# EAGLE design board_revA (EAGLE 7.1.0)
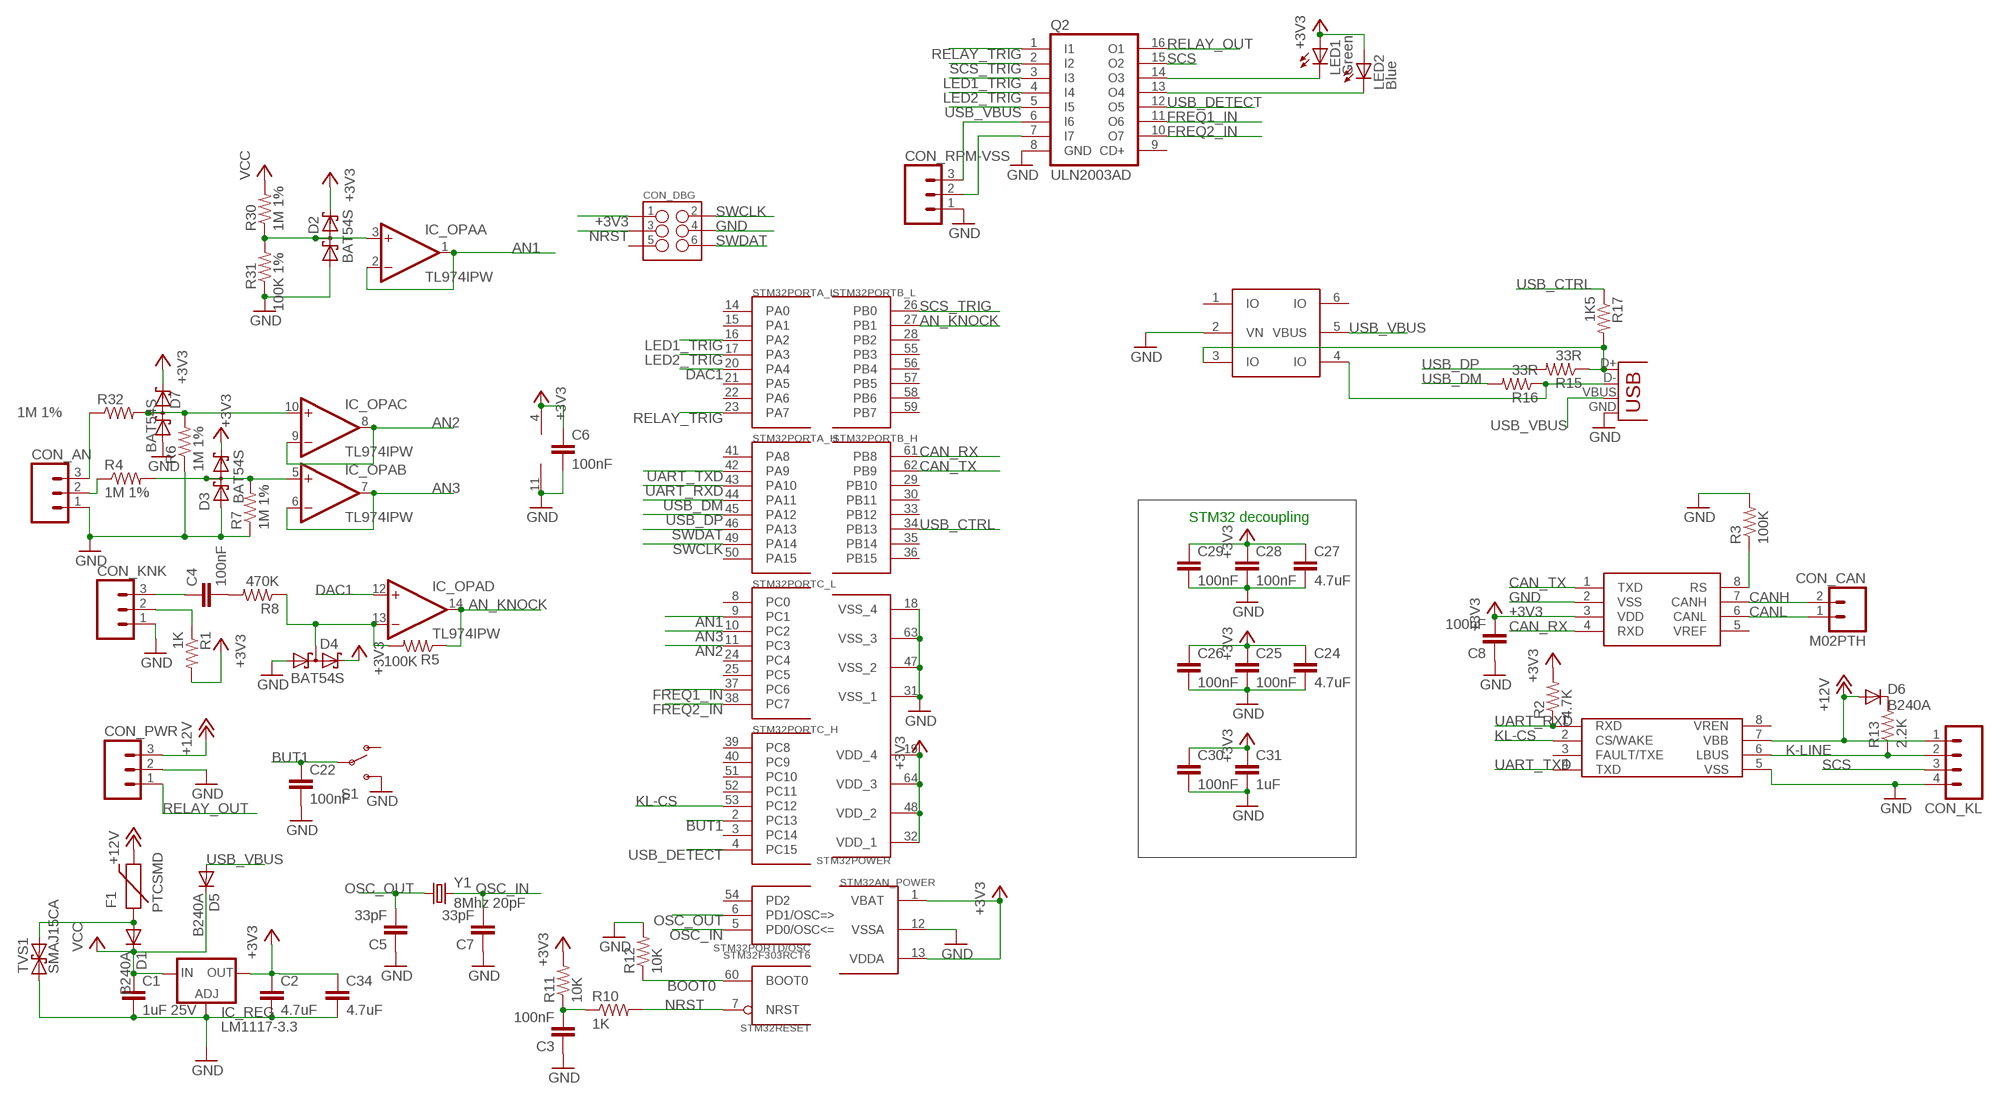
[diagram p0: schematic, sheet 1]

## Parts
C1  1uF 25V  CAP0603-CAP  [0603-CAP]
C2  4.7uF  CAP0603-CAP  [0603-CAP]
C3  100nF  CAP0603-CAP  [0603-CAP]
C4  100nF  CAP0603-CAP  [0603-CAP]
C5  33pF  CAP0603-CAP  [0603-CAP]
C6  100nF  CAP0603-CAP  [0603-CAP]
C7  33pF  CAP0603-CAP  [0603-CAP]
C8  100nF  CAP0603-CAP  [0603-CAP]
C22  100nF  CAP0603-CAP  [0603-CAP]
C24  4.7uF  CAP0603-CAP  [0603-CAP]
C25  100nF  CAP0603-CAP  [0603-CAP]
C26  100nF  CAP0603-CAP  [0603-CAP]
C27  4.7uF  CAP0603-CAP  [0603-CAP]
C28  100nF  CAP0603-CAP  [0603-CAP]
C29  100nF  CAP0603-CAP  [0603-CAP]
C30  100nF  CAP0603-CAP  [0603-CAP]
C31  1uF  CAP0603-CAP  [0603-CAP]
C34  4.7uF  CAP0603-CAP  [0603-CAP]
CON_AN  M03PTH  [1X03]
CON_CAN  M02PTH  [1X02]
CON_DBG  M03X22X3_SILK_SM  [2X3]
CON_KL  M04PTH  [1X04]
CON_KNK  M03PTH  [1X03]
CON_PWR  M03PTH  [1X03]
CON_RPM-VSS  M03PTH  [1X03]
CON_USB  USBSMD  [USB-MINIB]
D1  B240A  DIODESMA  [SMA-DIODE]
D2  BAT54S  [SOT23]
D3  BAT54S  [SOT23]
D4  BAT54S  [SOT23]
D5  B240A  DIODESMA  [SMA-DIODE]
D6  B240A  DIODESMA  [SMA-DIODE]
D7  BAT54S  [SOT23]
F1  PTCSMD  [PTC-1206]
IC_CAN  MAX3051  MCP2551  [SO08]
IC_KLINE  MCP2004  [SO08]
IC_OPA  TL974IPW  LMV324MZ  [TSSOP14]
IC_REG  LM1117-3.3  LD117ADT33TR  [DPACK]
LED1  Green  LED3MM  [LED3MM]
LED2  Blue  LED3MM  [LED3MM]
Q2  ULN2003AD  [SO16]
R1  1K  RESISTOR0603-RES  [0603-RES]
R2  4.7K  RESISTOR0603-RES  [0603-RES]
R3  100K  RESISTOR0603-RES  [0603-RES]
R4  1M 1%  RESISTOR0603-RES  [0603-RES]
R5  100K  RESISTOR0603-RES  [0603-RES]
R6  1M 1%  RESISTOR0603-RES  [0603-RES]
R7  1M 1%  RESISTOR0603-RES  [0603-RES]
R8  470K  RESISTOR0603-RES  [0603-RES]
R10  1K  RESISTOR0603-RES  [0603-RES]
R11  10K  RESISTOR0603-RES  [0603-RES]
R12  10K  RESISTOR0603-RES  [0603-RES]
R13  2.2K  RESISTOR0603-RES  [0603-RES]
R15  33R  RESISTOR0603-RES  [0603-RES]
R16  33R  RESISTOR0603-RES  [0603-RES]
R17  1K5  RESISTOR0603-RES  [0603-RES]
R30  1M 1%  RESISTOR0603-RES  [0603-RES]
R31  100K 1%  RESISTOR0603-RES  [0603-RES]
R32  1M 1%  RESISTOR0603-RES  [0603-RES]
S1  SWITCH-SPDTPTH  [SWITCH-SPDT]
STM32  STM32F303RCT6  STM32F10XRXT6  [TQFP64]
TVS1  SMAJ15CA  TVS  [SMA-DIODE]
TVS2  NUP4201MR6  [SOT23-6]
Y1  8Mhz 20pF  CRYSTALHC49US  [HC49US]

## Nets
+3V3: C2.1 C6.1 C8.2 C24.1 C25.1 C26.1 C27.1 C28.1 C29.1 C30.1 C31.1 C34.1 CON_DBG.1 D2.2(C2) D3.2(C2) D4.2(C2) D7.2(C2) IC_CAN.3(VDD) IC_OPA.4(P:V+) IC_REG.4(OUT) LED1.A LED2.A R1.2 R2.2 R11.2 STM32.1(AN_POWER:VBAT) STM32.13(AN_POWER:VDDA) STM32.19(POWER:VDD_4) STM32.32(POWER:VDD_1) STM32.48(POWER:VDD_2) STM32.64(POWER:VDD_3)
+12V: CON_KL.1 CON_PWR.3 D6.A F1.2 IC_KLINE.7(VBB)
AN1: IC_OPA.1(A:OUT) IC_OPA.2(A:-IN) STM32.9(PORTC_L:PC1)
AN2: IC_OPA.8(C:OUT) IC_OPA.9(C:-IN) STM32.11(PORTC_L:PC3)
AN3: IC_OPA.6(B:-IN) IC_OPA.7(B:OUT) STM32.10(PORTC_L:PC2)
AN_KNOCK: IC_OPA.14(D:OUT) R5.1 STM32.27(PORTB_L:PB1)
BOOT0: R12.1 STM32.60(RESET:BOOT0)
BUT1: C22.1 S1.2(P) STM32.2(PORTC_H:PC13)
CAN_RX: IC_CAN.4(RXD) STM32.61(PORTB_H:PB8)
CAN_TX: IC_CAN.1(TXD) STM32.62(PORTB_H:PB9)
CANH: CON_CAN.2 IC_CAN.7(CANH)
CANL: CON_CAN.1 IC_CAN.6(CANL)
DAC1: IC_OPA.12(D:+IN) STM32.20(PORTA_L:PA4)
FREQ1_IN: Q2.11(O6) STM32.37(PORTC_L:PC6)
FREQ2_IN: Q2.10(O7) STM32.38(PORTC_L:PC7)
GND: C1.2 C2.2 C3.1 C5.1 C6.2 C7.1 C8.1 C22.2 C24.2 C25.2 C26.2 C27.2 C28.2 C29.2 C30.2 C31.2 C34.2 CON_AN.1 CON_DBG.4 CON_KL.4 CON_KNK.1 CON_PWR.2 CON_RPM-VSS.1 CON_USB.GND D2.1(A1) D3.1(A1) D4.1(A1) D7.1(A1) IC_CAN.2(VSS) IC_KLINE.5(VSS) IC_OPA.11(P:V-) IC_REG.1(ADJ) Q2.8(GND) R3.2 R6.1 R7.1 R12.2 R31.1 S1.3(S) STM32.12(AN_POWER:VSSA) STM32.18(POWER:VSS_4) STM32.31(POWER:VSS_1) STM32.47(POWER:VSS_2) STM32.63(POWER:VSS_3) TVS1.A TVS2.2(VN)
K-LINE: CON_KL.2 IC_KLINE.6(LBUS) R13.1
KL-CS: IC_KLINE.2(CS/WAKE) STM32.53(PORTC_H:PC12)
LED1_TRIG: Q2.3(I3) STM32.16(PORTA_L:PA2)
LED2_TRIG: Q2.4(I4) STM32.17(PORTA_L:PA3)
N$1: CON_KNK.2 R1.1
N$2: CON_AN.3 R32.1
N$3: CON_AN.2 R4.1
N$4: C4.1 CON_KNK.3
N$5: D3.3(C1A2) IC_OPA.5(B:+IN) R4.2 R7.2
N$6: C4.2 R8.2
N$7: CON_USB.D+ R15.1 R17.2 TVS2.3(IO)
N$8: IC_CAN.8(RS) R3.1
N$9: D1.A F1.1 TVS1.C
N$10: LED1.K(C) Q2.14(O3)
N$11: LED2.K(C) Q2.13(O4)
N$12: D4.3(C1A2) IC_OPA.13(D:-IN) R5.2 R8.1
N$13: D6.C R13.2
N$16: CON_RPM-VSS.3 Q2.6(I6)
N$17: CON_USB.D- R16.1 TVS2.4(IO)
N$18: C3.2 R10.1 R11.1
N$21: CON_RPM-VSS.2 Q2.7(I7)
N$24: D2.3(C1A2) IC_OPA.3(A:+IN) R30.1 R31.2
N$25: D7.3(C1A2) IC_OPA.10(C:+IN) R6.2 R32.2
NRST: CON_DBG.3 R10.2 STM32.7(RESET:NRST)
OSC_IN: C7.2 STM32.5(PORTD/OSC:PD0/OSC<=) Y1.2
OSC_OUT: C5.2 STM32.6(PORTD/OSC:PD1/OSC=>) Y1.1
RELAY_OUT: CON_PWR.1 Q2.16(O1)
RELAY_TRIG: Q2.1(I1) STM32.23(PORTA_L:PA7)
SCS: CON_KL.3 Q2.15(O2)
SCS_TRIG: Q2.2(I2) STM32.26(PORTB_L:PB0)
SWCLK: CON_DBG.2 STM32.49(PORTA_H:PA14)
SWDAT: CON_DBG.6 STM32.46(PORTA_H:PA13)
UART_RXD: IC_KLINE.1(RXD) R2.1 STM32.43(PORTA_H:PA10)
UART_TXD: IC_KLINE.4(TXD) STM32.42(PORTA_H:PA9)
USB_CTRL: R17.1 STM32.34(PORTB_H:PB13)
USB_DETECT: Q2.12(O5) STM32.4(PORTC_H:PC15)
USB_DM: R16.2 STM32.44(PORTA_H:PA11)
USB_DP: R15.2 STM32.45(PORTA_H:PA12)
USB_VBUS: CON_USB.VBUS D5.A Q2.5(I5) TVS2.5(VBUS)
VCC: C1.1 D1.C D5.C IC_REG.3(IN) R30.2
Unconnected: CON_DBG.5 IC_CAN.5(VREF) IC_KLINE.3(FAULT/TXE) IC_KLINE.8(VREN) Q2.9(CD+) S1.1(O) STM32.3(PORTC_H:PC14) STM32.8(PORTC_L:PC0) STM32.14(PORTA_L:PA0) STM32.15(PORTA_L:PA1) STM32.21(PORTA_L:PA5) STM32.22(PORTA_L:PA6) STM32.24(PORTC_L:PC4) STM32.25(PORTC_L:PC5) STM32.28(PORTB_L:PB2) STM32.29(PORTB_H:PB10) STM32.30(PORTB_H:PB11) STM32.33(PORTB_H:PB12) STM32.35(PORTB_H:PB14) STM32.36(PORTB_H:PB15) STM32.39(PORTC_H:PC8) STM32.40(PORTC_H:PC9) STM32.41(PORTA_H:PA8) STM32.50(PORTA_H:PA15) STM32.51(PORTC_H:PC10) STM32.52(PORTC_H:PC11) STM32.54(PORTD/OSC:PD2) STM32.55(PORTB_L:PB3) STM32.56(PORTB_L:PB4) STM32.57(PORTB_L:PB5) STM32.58(PORTB_L:PB6) STM32.59(PORTB_L:PB7) TVS2.1(IO) TVS2.6(IO)

## Notes on the sheet
- STM32 decoupling

## Library data of the parts
C1 C2 C24 C27 C34 = SparkFun-Passives:CAP: Capacitor Standard 0603 ceramic capacitor, and 0.1" leaded capacitor.
C3-C8 C22 C25 C26 C28-C31 = SparkFun-Capacitors:CAP: Capacitor Standard 0603 ceramic capacitor, and 0.1" leaded capacitor.
CON_AN CON_KNK CON_PWR CON_RPM-VSS = SparkFun-Connectors:M03: Header 3 Standard 3-pin 0.1" header. Use with straight break away headers (SKU : PRT-00116), right angle break away headers (PRT-00553), swiss pins (PRT-00743), machine pins (PRT-00117), and female headers (PRT-00115). Molex polarized connector foot print use with SKU : PRT-08232 with associated crimp pins and housings.
CON_CAN = SparkFun-Connectors:M02: Standard 2-pin 0.1" header. Use with - straight break away headers ( PRT-00116) - right angle break away headers (PRT-00553) - swiss pins (PRT-00743) - machine pins (PRT-00117) - female headers (PRT-00115) Molex polarized connector foot print use with: PRT-08233 with associated crimp pins and housings. 2.54_SCREWTERM for use with PRT-10571. 3.5mm Screw Terminal footprints for PRT-08084 5mm Screw Terminal footprints for use with PRT-08433
CON_DBG = SparkFun-Connectors:M03X2: 2x3 .1" header. Shrouded, with keying- CONN-10681 SMT- CONN-11415 Pogo pins- HW-11044
CON_KL = SparkFun-Connectors:M04: Header 4 Standard 4-pin 0.1" header. Use with straight break away headers (SKU : PRT-00116), right angle break away headers (PRT-00553), swiss pins (PRT-00743), machine pins (PRT-00117), and female headers (PRT-00115). Molex polarized connector foot print use with SKU : PRT-08231 with associated crimp pins and housings. 1MM SMD Version SKU: PRT-10208
CON_USB = SparkFun-Connectors:USB: USB Connectors USB-B-PTH is fully proven SKU : PRT-00139/CONN-08278 USB-miniB is fully proven SKU : PRT-00587 USB-A-PCB is untested. USB-A-H is throughly reviewed, but untested. Spark Fun Electronics SKU : PRT-00437 USB-B-SMT is throughly reviewed, but untested. Needs silkscreen touching up. USB-A-S has not been used/tested USB-MB-H has not been used/tested USB-MICROB has been used. CONN-09505
D1 D5 D6 = SparkFun-DiscreteSemi:DIODE: Diode These are standard reverse protection diodes and small signal diodes. SMA package can handle up to about 1A. SOD-323 can handle about 200mA. What the SOD-323 package when ordering, there are some mfgs out there that are 5-pin packages.
D2-D4 D7 = diode:BAT54S: Schottky Diodes Pin connection corrected 2011-05-04 Source: Fairchild .. BAT54.pdf
F1 = SparkFun-PowerIC:PTC: Resettable Fuse PTC Resettable Fuse. Spark Fun Electronics SKU : COM-08357
IC_CAN = SparkFun-DigitalIC:MCP2551: CAN transceiver
IC_KLINE = misc:MCP2004
IC_OPA = linear:LMV324?*: Quad General Purpose, Low Voltage, Rail-to-Rail Output Operational Amplifiers Source: http://www.national.com/mpf/LM/LMV321.html http://www.national.com/dt/lmv_qual.pdf
IC_REG = v-reg:LD117A?*: Low drop fixed and adjustable positive voltage regulators 1 A Source: http://www.st.com/stonline/products/literature/ds/7194/ld1117axx.pdf
LED1 LED2 = SparkFun-LED:LED: LEDs Standard schematic elements and footprints for 5mm, 3mm, 1206, and 0603 sized LEDs. 5mm - Spark Fun Electronics SKU : COM-00529 (and others)
Q2 = misc:ULN2003A: DRIVER ARRAY
R1-R8 R10-R13 R15-R17 R30-R32 = SparkFun-Resistors:RESISTOR: Resistor Basic schematic elements and footprints for 0603, 1206, and PTH resistors.
S1 = SparkFun-Electromechanical:SWITCH-SPDT: SPDT Switch Simple slide switch, Spark Fun Electronics SKU : COM-00102 DPDT SMT slide switch, AYZ0202, SWCH-08179
STM32 = stm32:STM32F10XRXT6: STM32F101/103 64pin LQFP
TVS1 = SparkFun-DiscreteSemi:TVS: Transient voltage suppressor- prevents ESD on inputs. Ignore package description- MBRA140 is NOT this type of part!!!
TVS2 = misc:NUP4201MR6
Y1 = SparkFun-FreqCtrl:CRYSTAL: Various standard crystals. Proven footprints. Spark Fun Electronics SKU : COM-00534

## Net classes
1 HV: width 0.813 mm, clearance 0.61 mm

## Board
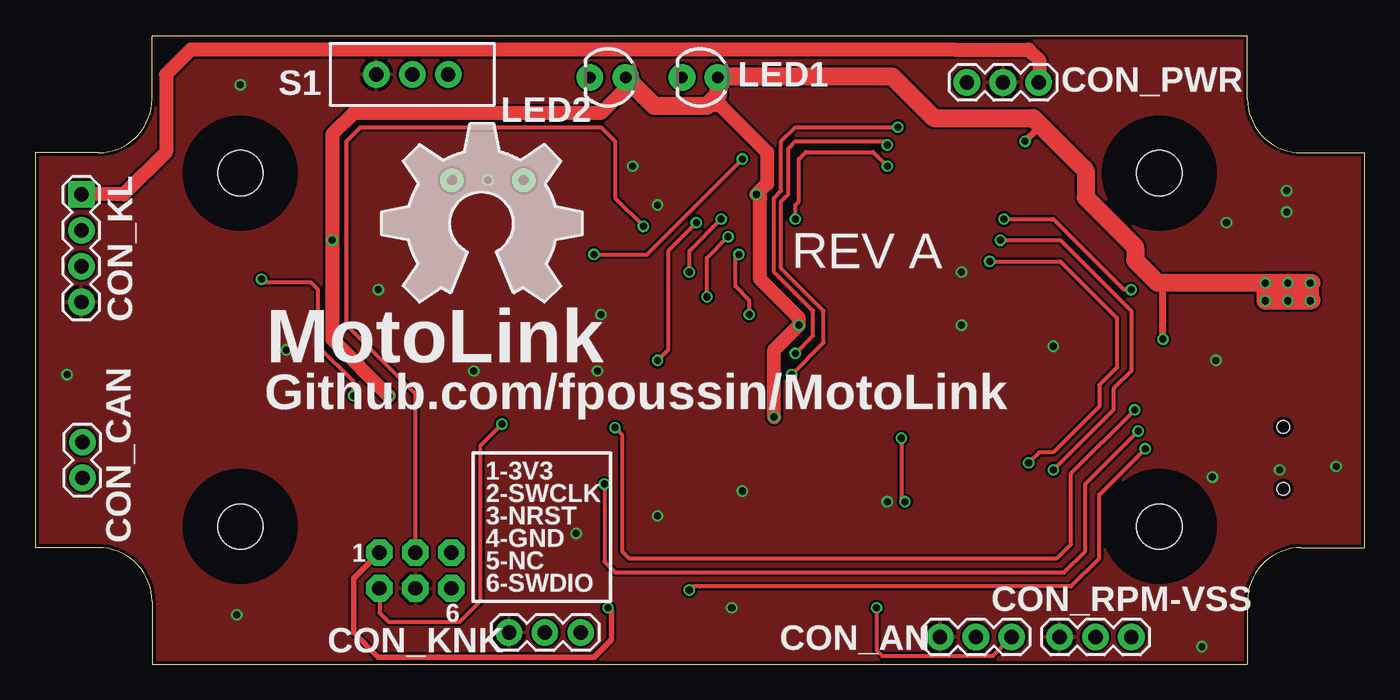
[diagram p1: board, top side]
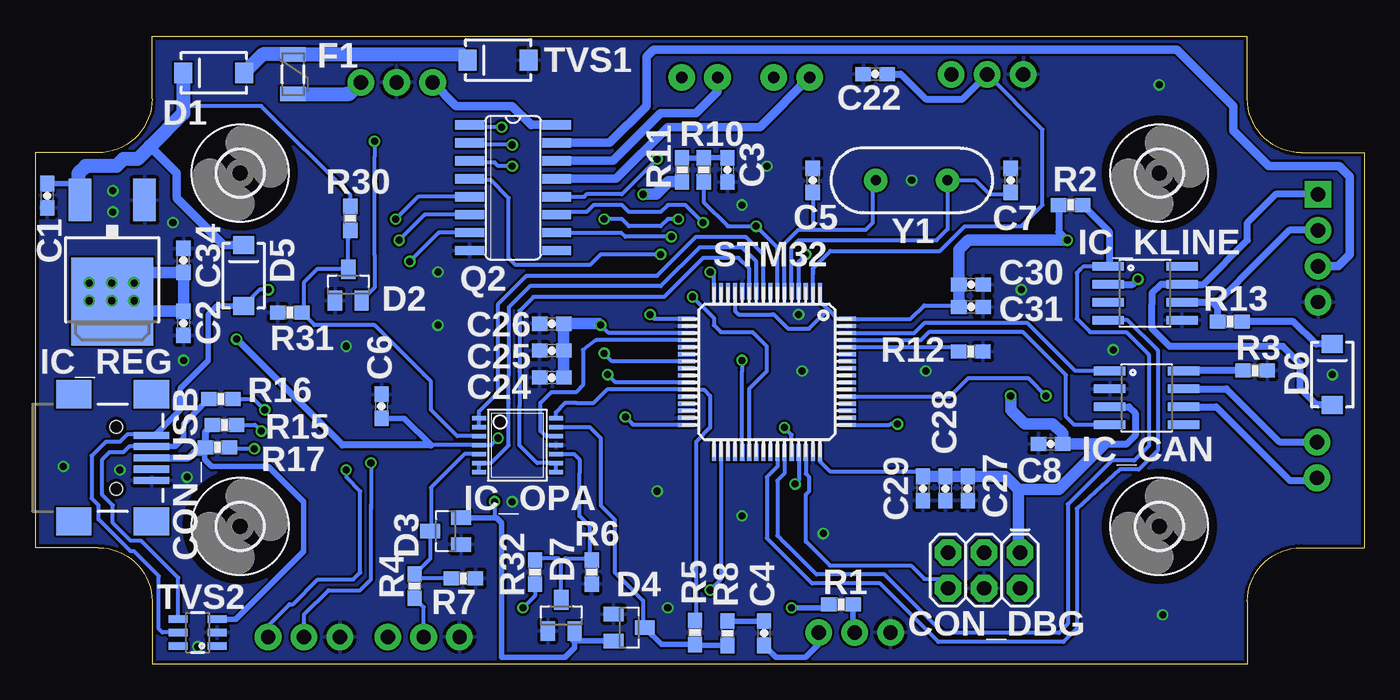
[diagram p2: board, bottom side, seen from below]

Size 93.98 x 44.45 mm. Coordinates in mm from the lower left corner, seen from the top.
Outline: 8.26,0 85.72,0 85.72,4.45 arc-90 89.53,8.26 93.98,8.26 93.98,36.2 89.53,36.2 arc-90 85.72,40.01 85.72,44.45 8.26,44.45 8.26,40.01 arc-90 4.45,36.2 0,36.2 0,8.26 4.45,8.26 arc-90 8.26,4.45 8.26,0
Copper layers (1*16): Top 0.035mm / dielectric 1.5mm / Bottom 0.035mm
Design rules "SeeedStudio_2layer_DRU_no_angle_20140221 *": minimum track width 8mil, minimum drill 12mil, track to track 6mil, track to pad 6mil, pad to pad 6mil, via to via 6mil, smd to smd 0mil, copper to edge 10mil, drill to drill 10mil, minimum pad ring 10mil, minimum via ring 6mil, stop-mask expansion 2mil, vias tented up to drill 100mil, thermal gap 10mil

### Footprints (pad centres in the part's own frame; a part is rotated, then mirrored left to right if it is on the bottom)
0603-CAP = smd 1.1 x 1: 1 -0.85,0; 2 0.85,0
1X03 = drill 1.016 pad 1.88: 1 0,0; 2 2.54,0; 3 5.08,0
1X02 = drill 1.016 pad 1.88: 1 0,0; 2 2.54,0
2X3 = drill 1.016 pad 1.88 octagon: 1 0,0; 2 0,2.54; 3 2.54,0; 4 2.54,2.54; 5 5.08,0; 6 5.08,2.54
1X04 = drill 1.016 pad 1.88 square: 1 0,0 | drill 1.016 pad 1.88: 2 2.54,0; 3 5.08,0; 4 7.62,0
USB-MINIB = smd 2.5 x 0.5: D+ 2.5,0; D- 2.5,0.8; GND 2.5,-1.6; ID 2.5,-0.8; VBUS 2.5,1.6 | smd 2.5 x 2: MTN1 -3,4.5; MTN2 2.5,4.5; MTN3 -3,-4.5; MTN4 2.5,-4.5 | hole 0.9: 0,2.2; 0,-2.2
SMA-DIODE = smd 1.27 x 1.47: A -2.15,0; C 2.15,0
SOT23 = smd 1 x 1.4: 1 -0.95,-1.1; 2 0.95,-1.1; 3 0,1.1
PTC-1206 = smd 1 x 1.8: 1 -1.4,0; 2 1.4,0
SO08 = smd 0.61 x 2.21: 1 -1.905,-2.616; 2 -0.635,-2.616; 3 0.635,-2.616; 4 1.905,-2.616; 5 1.905,2.616; 6 0.635,2.616; 7 -0.635,2.616; 8 -1.905,2.616
TSSOP14 = smd 0.305 x 0.991: 1 -1.905,-2.718; 2 -1.27,-2.718; 3 -0.635,-2.718; 4 0,-2.718; 5 0.635,-2.718; 6 1.27,-2.718; 7 1.905,-2.718; 8 1.905,2.718; 9 1.27,2.718; 10 0.635,2.718; 11 0,2.718; 12 -0.635,2.718; 13 -1.27,2.718; 14 -1.905,2.718
DPACK = smd 1.6 x 3: 1 -2.28,-4.8; 3 2.28,-4.8 | smd 5.8 x 6.2: 4 0,2.38
LED3MM = drill 0.813 pad 1.88: A -1.27,0; K 1.27,0
SO16 = smd 0.66 x 2.032: 1 -4.445,-3.073; 2 -3.175,-3.073; 3 -1.905,-3.073; 4 -0.635,-3.073; 5 0.635,-3.073; 6 1.905,-3.073; 7 3.175,-3.073; 8 4.445,-3.073; 9 4.445,3.073; 10 3.175,3.073; 11 1.905,3.073; 12 0.635,3.073; 13 -0.635,3.073; 14 -1.905,3.073; 15 -3.175,3.073; 16 -4.445,3.073
0603-RES = smd 1.1 x 1: 1 -0.85,0; 2 0.85,0
SWITCH-SPDT = drill 1.016 pad 1.88: 1 0,2.54; 2 0,0; 3 0,-2.54
TQFP64 = smd 1.2 x 0.3: 1 -5.7,3.75; 2 -5.7,3.25; 3 -5.7,2.75; 4 -5.7,2.25; 5 -5.7,1.75; 6 -5.7,1.25; 7 -5.7,0.75; 8 -5.7,0.25; 9 -5.7,-0.25; 10 -5.7,-0.75; 11 -5.7,-1.25; 12 -5.7,-1.75; 13 -5.7,-2.25; 14 -5.7,-2.75; 15 -5.7,-3.25; 16 -5.7,-3.75; 33 5.7,-3.75; 34 5.7,-3.25; 35 5.7,-2.75; 36 5.7,-2.25; 37 5.7,-1.75; 38 5.7,-1.25; 39 5.7,-0.75; 40 5.7,-0.25; 41 5.7,0.25; 42 5.7,0.75; 43 5.7,1.25; 44 5.7,1.75; 45 5.7,2.25; 46 5.7,2.75; 47 5.7,3.25; 48 5.7,3.75 | smd 0.3 x 1.2: 17 -3.75,-5.7; 18 -3.25,-5.7; 19 -2.75,-5.7; 20 -2.25,-5.7; 21 -1.75,-5.7; 22 -1.25,-5.7; 23 -0.75,-5.7; 24 -0.25,-5.7; 25 0.25,-5.7; 26 0.75,-5.7; 27 1.25,-5.7; 28 1.75,-5.7; 29 2.25,-5.7; 30 2.75,-5.7; 31 3.25,-5.7; 32 3.75,-5.7; 49 3.75,5.7; 50 3.25,5.7; 51 2.75,5.7; 52 2.25,5.7; 53 1.75,5.7; 54 1.25,5.7; 55 0.75,5.7; 56 0.25,5.7; 57 -0.25,5.7; 58 -0.75,5.7; 59 -1.25,5.7; 60 -1.75,5.7; 61 -2.25,5.7; 62 -2.75,5.7; 63 -3.25,5.7; 64 -3.75,5.7
SOT23-6 = smd 0.55 x 1.35: 1 -0.95,-1.375; 2 0,-1.375; 3 0.95,-1.375; 4 0.95,1.375; 5 0,1.375; 6 -0.95,1.375
3,2 = hole 3.2: 0,0
HC49US = drill 0.7 pad 1.651: 1 -2.54,0; 2 2.54,0

### Placement (x,y rotation side)
C1  93.14,33.16 270 bottom
C2  83.5,24.13 270 bottom
C3  45.03,34.97 90 bottom
C4  42.44,2.19 90 bottom
C5  39,34.25 270 bottom
C6  69.5,18.25 90 bottom
C7  25,34.25 270 bottom
C8  22.18,15.59 0 bottom
C22  34.58,41.76 180 bottom
C24  57.47,20.29 180 bottom
C25  57.47,22.19 180 bottom
C26  57.47,24.1 180 bottom
C27  28.03,12.44 270 bottom
C28  29.62,12.44 270 bottom
C29  31.21,12.44 270 bottom
C30  27.81,26.87 0 bottom
C31  27.81,25.29 0 bottom
C34  83.5,28.57 90 bottom
CON_AN  63.98,1.93 0 top
CON_CAN  3.33,13.19 90 top
CON_DBG  24.34,7.92 180 bottom
CON_KL  3.25,33.25 270 top
CON_KNK  33.5,2.25 0 top
CON_PWR  65.89,41.17 0 top
CON_RPM-VSS  72.44,1.93 0 top
CON_USB  88.27,14.61 0 bottom
D1  81.36,41.84 180 bottom
D2  71.84,26.85 0 bottom
D3  64.96,9.42 90 bottom
D4  51.98,2.6 270 bottom
D5  79.25,27.5 90 bottom
D6  2.25,20.5 90 bottom
D7  56.78,3.46 0 bottom
F1  75.75,41.75 270 bottom
IC_CAN  15.38,18.85 270 bottom
IC_KLINE  15.5,26.25 270 bottom
IC_OPA  59.88,15.51 270 bottom
IC_REG  88.54,28.05 180 bottom
LED1  47,41.52 180 top
LED2  40.49,41.52 180 top
Q2  60.19,33.72 270 bottom
R1  37,4.25 180 bottom
R2  20.75,32.5 180 bottom
R3  7.71,20.78 0 bottom
R4  67.16,5.53 90 bottom
R5  47.33,2.25 270 bottom
R6  54.63,6.53 90 bottom
R7  63.7,6.08 180 bottom
R8  45.02,2.19 90 bottom
R10  46.71,34.99 270 bottom
R11  48.23,34.99 270 bottom
R12  27.82,22.13 0 bottom
R13  9.5,24.25 0 bottom
R15  80.6,16.94 0 bottom
R16  80.85,18.78 0 bottom
R17  81.1,15.36 180 bottom
R30  71.69,31.55 90 bottom
R31  75.98,24.9 0 bottom
R32  58.65,6.51 90 bottom
S1  26.66,41.74 270 top
STM32  42.24,20.69 270 bottom
TVS1  61.25,42.75 180 bottom
TVS2  82.5,2.25 90 bottom
U$2  [3,2]  14.5,34.75 0 bottom
U$3  [3,2]  14.5,9.75 0 bottom
U$4  [3,2]  79.5,34.75 0 bottom
U$5  [3,2]  79.5,9.75 0 bottom
U$6  [OSHW_FILLX500_NOTEXT]  24.5,25.6 0 top
Y1  32,34.25 0 bottom

### Tracks (layer width: path | path; a pad name or v marks a point on that pad's centre or on a via)
+3V3  (via drill 0.5)
  Top 0.3: 70.8,38.42 70.8,37.8 | 79.75,26.49 80.25,26.99 | v61.25,16 61.25,11.75 v61.5,11.5 | v87,25.72 87,25.75 | v87,26.99 v87,27
  Top 0.4: CON_DBG.1 22.5,6.07 22.5,2.25 24.25,0.5 35.75,0.5 39.5,0.5 40.75,1.75 40.75,3.75 v40.5,4
  Top 0.5: LED1.A 48.27,41.58 | 70.8,37.8 v70,37 | v79.75,23 79.75,26.49
  Top 0.8: 47.5,39.5 48.5,39.5
  Top 1: 48.5,39.5 51.75,36.25 51.75,34 v51,33.25 51.25,33 51.25,27.25 54,24.5 v54,24 52.25,22.25 v52.25,17.5 | 41.7,41.5 41.7,40.7 40,39 22.5,39 21,37.5 v21,30 21,23 v25,19
  Top 1.27: LED1.A 48.27,40.27 47.5,39.5 43.78,39.5 LED2.A 41.73,41.52 41.7,41.5 | 48.27,41.58 48.26,41.59 60.59,41.59 63.54,38.64 70.58,38.64 71.11,38.11 | 70.8,38.42 71.11,38.11 | 71.11,38.11 74.3,34.92 74.3,33.02 77.79,29.53 77.79,28.57 79.06,27.3 79.38,26.99 80.25,26.99 v87,26.99 v87,25.72 | v88.58,25.72 v88.58,26.99 | v90.17,25.72 v90.17,26.99 | v87,27 90.25,27 | 87,25.75 90.25,25.75
  Bottom 0.29: STM32.64 37.25,24.44 | 44.49,24.99 44.25,24.75 41.87,24.75 41.86,24.74
  Bottom 0.3: IC_REG.4 88.86,25.14 89.07,24.93 | STM32.48 38.49,14.36 37.78,13.65 31.57,13.65 C29.1 | STM32.64 32.08,24.44 31.11,25.4 28.77,25.4 C31.1 | 18.45,15.59 18.41,15.56 | 83.5,25.08 C2.1 | v87,26.99 87,27.21 86.48,27.73 | STM32.19 51,23.44 53.44,23.44 v54,24 | v70,37 70,35.92 70,29 70,26.64 D2.2 | STM32.32 51.69,16.94 51.75,17 v52.25,17.5 | 66,15.51 IC_OPA.4 61.74,15.51 v61.25,16 | STM32.1 38.49,25.68 38.16,25.34 37.91,25.09 | 37.91,25.09 37.25,24.44 | STM32.13 44.49,24.99 | 41.87,24.75 41.75,24.75 40.75,23.75 39.5,23.75 39.25,23.75 37.91,25.09 | v61.5,11.5 61.5,10.37
  Bottom 0.4: D4.2 55.95,1.65 D7.2 55.84,1.17 56.5,0.5 61,0.5 61,10 61.37,10.37 61.5,10.37 D3.2 | 88.7,24.98 88.86,25.14 | 83.5,27.62 C34.1 | C30.1 C31.1 | C6.1 67.89,17.4 66,15.51 | v40.5,4 38.1,4 R1.2
  Bottom 0.5: IC_CAN.3 16.63,18.21 16.19,17.78 16.19,16.19 16.83,15.56 18.41,15.56 | 54.1,24.1 v54,24 | 66,15.51 72.26,15.51 v79.75,23 | R2.2 21.6,30.6 v21,30
  Bottom 0.8: C2.1 88.7,24.98 | C34.1 86.48,27.73 | 83.5,25.08 83.5,27.62 | C29.1 C28.1 C27.1 25.36,13.29 24.45,12.38 | 24.45,12.38 24.45,8.02 CON_DBG.1 | 18.41,15.56 21.59,12.38 24.45,12.38 | 18.45,15.59 C8.2 21.32,16.32 22,17 24,17 25,18 v25,19 | v90.17,25.72 89.85,25.72 89.07,24.93 | v88.58,25.72 88.58,25.7 IC_REG.4 | C24.1 C25.1 C26.1 54.1,24.1 | v51,33.25 50.08,33.25 49.19,34.14 R11.2 | C31.1 28.66,29.34 28,30 v21,30
+12V
  Top 1: CON_KL.1 6.25,33.25 9.25,36.25 9.25,41.75 11,43.5 65,43.5 70.25,43.5 71,42.75 71,41.35 71,41.2 CON_PWR.3
  Bottom 0.5: CON_KL.1 6.25,33.25 8.25,31.25 8.25,30 11.35,26.9 11.37,26.89 IC_KLINE.7 14.37,26.89 15,26.25 15,25.5 15,23.75 13.75,22.5 5.75,22.5 4.5,21.25 4.5,19.5 3.35,18.35 D6.A
  Bottom 1: F1.2 72,40.35 71.79,40.35 CON_PWR.3
AN1
  Bottom 0.3: IC_OPA.2 IC_OPA.1 62.6,17.9 61.25,19.25 61.25,25.5 59.25,27.5 50,27.5 47.25,30.25 43.75,30.25 43.25,29.75 42.49,28.99 STM32.9
AN2
  Bottom 0.3: IC_OPA.8 IC_OPA.9 58.49,14.24 59.75,15.5 59.75,18.25 59.75,20.75 59.75,25 58.75,26 49.5,26 46.75,28.75 44.25,28.75 43.49,27.99 STM32.11
AN3
  Bottom 0.3: IC_OPA.7 IC_OPA.6 61.76,14.24 60.5,15.5 60.5,18 60.5,18.5 60.5,18.75 60.5,20.5 60.5,25.25 59,26.75 49.75,26.75 47,29.5 44,29.5 42.99,28.49 STM32.10
AN_KNOCK
  Bottom 0.3: IC_OPA.14 57.17,17.83 56.5,18.5 55.75,18.5 54.5,18.5 53.56,19.44 STM32.27 46.69,19.44 46.25,19 46.25,16.75 47.25,15.75 47.25,13 47.25,3.18 R5.1
BOOT0
  Bottom 0.3: STM32.60 28.99,22.44 R12.1
BUT1
  Bottom 0.3: STM32.2 38.99,27.57 | 38.99,27.57 38.99,28.01 | 38.99,28.01 38.99,27.57 | 26.67,41.73 S1.2 22.75,37.84 22.75,32.5 24.25,31 28.25,31 30,29.25 37.75,29.25 38.99,28.01 | 38.99,27.57 38.99,28.01
  Bottom 0.5: C22.1 32.76,41.76 31,40 28.4,40 S1.2
CAN_RX
  Bottom 0.3: STM32.61 31.35,22.94 30.8,23.5 24.13,23.5 21.09,20.45 21.09,17.53 20.5,16.95 IC_CAN.4
CAN_TX
  Bottom 0.3: STM32.62 31.8,23.44 31.11,24.13 23.81,24.13 20.44,20.75 IC_CAN.1
CANH
  Bottom 0.5: IC_CAN.7 9.73,19.48 6,15.75 3.35,15.75 CON_CAN.2
CANL
  Bottom 0.5: IC_CAN.6 10.46,18.21 5.25,13 3.52,13 CON_CAN.1
DAC1
  Bottom 0.3: STM32.20 54.31,22.94 55.25,22.25 55.25,19.75 55.75,19.25 57.5,19.25 58.25,18.5 58.25,16.5 57.89,16.14 IC_OPA.12
FREQ1_IN  (via drill 0.5)
  Top 0.3: v46.75,31.25 44.75,29.25 44.75,22.25 v44,21.5
  Bottom 0.3: 46.81,31.31 v46.75,31.25 47.31,31.81 48,32.5 49.25,32.5 49.75,32 52,32 52.5,32.5 54.5,32.5 55,32 56.43,32 Q2.11 | v44,21.5 44,20.75 43.99,20.74 STM32.37
FREQ2_IN  (via drill 0.5)
  Top 0.3: v47.5,26 47.5,28.75 v49,30.25
  Bottom 0.29: 46,24.5 46,24 45.5,23.5 43.25,23.5 42.25,22.5
  Bottom 0.3: STM32.38 43.49,19.51 42.25,20.75 42.25,22.5 | 46,24.5 v47.5,26 | v49,30.25 52.25,30.25 52.54,30.54 Q2.10
GND  (via drill 0.5)
  other vias: 50,12.25 39.75,20.75 14.5,41 14.25,3.5 38.25,9.25 44,10.5 60.25,11.5 82.5,1.25 88.5,32 32,34.25 65.5,24 2.25,20.5 42.25,35.25 40,24.75 24.25,26.5 31,20.75 17.75,22.25 44,32.5 49.25,4 72,22.5 84.25,31.25 88.5,33.5 83.5,21.5 65.5,27.75 88,13.75 92,14 83.25,13.25
  pour Bottom: 0,44.45 93.98,44.45 93.98,0 0,0
  pour Top: 0,44.45 93.98,44.45 93.98,0 0,0
K-LINE
  Bottom 0.5: CON_KL.2 5.29,30.71 8,28 9.62,26.38 10.37,25.63 10.63,25.61 10.75,25.61 | IC_KLINE.6 10.75,25.61 | R13.1 10.35,25.21 10.75,25.61
KL-CS  (via drill 0.5)
  Top 0.3: v22.5,19 22.5,20 20,22.5 20,26.5 19.5,27 16.25,27 v16,27.25
  Bottom 0.3: v22.5,19 23.75,20.25 28,20.25 29.31,18.94 STM32.53
  Bottom 0.5: IC_KLINE.2 16.39,26.89 16.36,26.89 v16,27.25
LED1_TRIG  (via drill 0.5)
  Top 0.3: v46.25,27.75 46.25,29.25 v48.5,31.5 | v53.75,31.5 53.75,32.5 54,32.75 54,35.75 54.5,36.25 59.25,36.25 v60.25,35.25
  Bottom 0.3: STM32.16 45.99,27.49 v46.25,27.75 | v60.25,35.25 61.25,35.25 61.5,35.5 62.64,35.5 Q2.3 | v48.5,31.5 49.25,31.5 49.75,31 52,31 52.5,31.5 v53.75,31.5
LED2_TRIG  (via drill 0.5)
  Top 0.3: v50.5,24.75 50.5,25.75 49.5,26.75 49.5,28.75 v49.75,29
  Bottom 0.3: STM32.17 50.19,24.44 v50.5,24.75 | v49.75,29 54,29 54.75,28.25 60,28.25 60.5,28.75 60.5,33 61.75,34.25 62.91,34.25 Q2.4
N$1
  Bottom 0.4: R1.1 36.15,2.36 CON_KNK.2
N$2  (via drill 0.5)
  Top 0.3: v59.5,4 59.5,1 59.9,0.6 67.73,0.6 CON_AN.3
  Bottom 0.3: R32.1 58.65,4.85 v59.5,4
N$3
  Bottom 0.3: CON_AN.2 66.52,4.05 R4.1
N$4
  Bottom 0.4: CON_KNK.3 38.58,1.42 39.5,0.5 41.59,0.5 C4.1
N$5
  Bottom 0.3: R7.2 66.85,6.08 R4.2 66.06,7.48 D3.3 66,9.48 66,12.5 63.63,14.87 IC_OPA.5
N$6
  Bottom 0.4: C4.2 R8.2
N$7
  Bottom 0.4: TVS2.3 79.8,3.2 75,8 75,11.5 77.5,14 81.5,14 82,14.5 82,15.3 R17.2
  Bottom 0.5: R15.1 81.95,16.44 R17.2 82.05,15 82.75,15 83.14,14.61 83.75,14.61 CON_USB.D+
N$8
  Bottom 0.5: R3.1 12.74,20.78 IC_CAN.8
N$9
  Bottom 1: D1.A 77.9,43.15 F1.1 63.8,43.15 TVS1.C
N$10
  Bottom 0.6: LED1.K 45.73,40.52 47.25,39 49.75,39 53.13,35.62 Q2.14
N$11
  Bottom 0.6: Q2.13 52.9,34.35 49.25,38 42.74,38 LED2.K
N$12
  Bottom 0.3: D4.3 51,2.72 51,4.5 52,5.5 52.25,5.75 53,6.5 53,10.25 54,11.25 54,12.25 54,16 54.78,16.78 IC_OPA.13
  Bottom 0.4: R8.1 47.27,1.34 R5.2 49.68,1.4 D4.3
N$13
  Bottom 0.5: D6.C 3.4,22.65 5,24.25 R13.2
N$16  (via drill 0.5)
  Top 0.3: v68.25,30 72.5,30 75.5,27 77.5,25 77.5,20.75 76.25,19.5 76.25,18 75.5,17.25 v72,13.75
  Bottom 0.3: CON_RPM-VSS.3 77.52,2.73 76,4.25 75.75,4.25 74,6 71.5,6 71,6.5 71,12.25 72,13.25 v72,13.75 | Q2.6 66.44,31.81 v68.25,30
N$17
  Bottom 0.3: TVS2.4 83.88,6.12 86.5,8.75 87.25,8.75 88.5,10 88.5,11.25 89.25,12 89.25,14.5 88.75,15 87.75,15 87.34,15.4 CON_USB.D-
  Bottom 0.4: 83.5,17 82.75,17.75
  Bottom 0.406: CON_USB.D- 84.09,15.4 83.5,16 83.5,17 | R16.1 82.22,18.28 82.75,17.75
N$18
  Bottom 0.3: 48.21,35.82 R11.1
  Bottom 0.4: 48.21,35.82 46.73,35.82 R10.1 45.06,35.84 C3.2
N$21  (via drill 0.5)
  Top 0.3: v67.5,28.5 72.5,28.5 76.5,24.5 76.5,21 75.25,19.75 75.25,18.25 72,15 71,15 v70.25,14.25
  Bottom 0.3: CON_RPM-VSS.2 74.98,3.52 73.25,5.25 71,5.25 70.25,6 70.25,11 | 70.25,11 70.25,11.25 | Q2.7 65.46,30.54 67,29 v67.5,28.5 | v70.25,14.25 70.25,11
N$24
  Bottom 0.3: R30.1 71.84,30.05 D2.3 74.05,27.95 75,27 75,25.03 R31.2 74.23,24 70,24 66.5,20.5 66,20 66,18 64.14,16.14 IC_OPA.3
N$25
  Bottom 0.3: IC_OPA.10 55.87,14.87 55.5,14.5 55.5,13.5 55.5,10.5 54.75,9.75 54.75,7.5 | 54.75,7.5 56.5,7.5 56.78,7.21 D7.3 56.78,7.29 57,7.5 58.51,7.5 R32.2 | 54.75,7.5 R6.2
NRST  (via drill 0.5)
  Top 0.3: CON_DBG.3 26.88,19.12 22,24 22,37 23,38 40,38 41,37 41,33 v43,31
  Bottom 0.3: STM32.7 41.49,29.49 v43,31 45,31 46.71,32.71 R10.2
OSC_IN
  Bottom 0.3: STM32.5 40.49,29.51 40,30 30.42,30 30.25,30 29.46,30.79 Y1.2 27.5,34.25 26.5,33.25 25.4,33.25 C7.2
OSC_OUT
  Bottom 0.3: STM32.6 40.99,29.76 40,30.75 39,30.75 | 39,30.75 35.25,30.75 34.75,31.25 34.75,34.04 Y1.1 | C5.2 39,30.75
RELAY_OUT
  Bottom 0.6: Q2.16 58.91,38.16 60.25,39.5 64.22,39.5 CON_PWR.1
RELAY_TRIG  (via drill 0.5)
  Top 0.3: v53.75,22 55,23.25 55,25 52.25,27.75 52.25,33 52.75,33.5 52.75,37 53.75,38 v61,38
  Bottom 0.3: STM32.23 53.19,21.44 v53.75,22 | v61,38 63.1,38 Q2.1
SCS
  Bottom 0.6: CON_KL.3 1.83,28.17 1,29 1,34.5 1.75,35.25 6.75,35.25 9.25,37.75 9.25,39.5 13.25,43.5 50,43.5 50.25,43.5 50.75,43 50.75,39.5 53.36,36.89 Q2.15
SCS_TRIG  (via drill 0.5)
  Top 0.3: v53.5,20.5 55.75,22.75 55.75,25 52.75,28 52.75,32.75 53.25,33.25 53.25,36.5 53.75,37 60,37 v60.25,36.75
  Bottom 0.3: STM32.26 52.94,19.94 v53.5,20.5 | v60.25,36.75 62.66,36.75 Q2.2
SWCLK  (via drill 0.5)
  Top 0.3: CON_DBG.2 24.34,3.66 25,3 30,3 31.5,4.5 31.5,15.5 v33,17
  Bottom 0.3: v33,17 33.5,17 33.56,16.94 STM32.49
SWDAT
  Bottom 0.29: STM32.46 39.49,13.49 39.25,13.25 39.25,12.25 39.5,12 39.5,8.7 39.49,8.69
  Bottom 0.3: CON_DBG.6 30.08,6.03 31.11,6.03 32.07,6.99 37.78,6.99 39.49,8.69
UART_RXD
  Bottom 0.29: STM32.43 40.99,13.76 41,13.5 41.5,13 41.5,9.12 40.99,8.61
  Bottom 0.3: 40.8,8.41 38.73,6.35 33.92,6.35 29.8,2.22 21.59,2.22 20.95,2.86 20.95,11.31 17.85,14.42 16.26,14.42 15.24,15.44 15.24,21.91 16.83,23.5 19.37,23.5 20.32,24.45 20.32,27.69 20.09,27.92 19.83,28.16 IC_KLINE.1 | 40.8,8.41 40.96,8.57 | 40.99,8.61 40.8,8.41
  Bottom 0.5: IC_KLINE.1 18.03,28.24 18.03,30.63 R2.1
UART_TXD
  Bottom 0.29: STM32.42 41.49,14.01 42.25,13.25 42.25,8.91 41.49,8.15
  Bottom 0.3: 41.49,8.15 40.32,6.99 39.05,5.71 34.24,5.71 33.92,5.4 30.11,1.59 21.27,1.59 20.32,2.54 20.32,11 17.28,13.79 15.94,13.79 14.61,15.12 14.61,22.23 16.74,24.36 18.1,24.36 IC_KLINE.4
USB_CTRL  (via drill 0.5)
  Top 0.3: v78.5,15.25 75.25,12 75.25,7.5 73.25,5.5 47,5.5 46.5,5.5 v46.25,5.25
  Bottom 0.3: STM32.34 45.49,6.01 v46.25,5.25 | v78.5,15.25 80.1,15.25 R17.1
USB_DETECT  (via drill 0.5)
  Top 0.3: v39.5,29 43.25,29 v50,35.75
  Bottom 0.29: 52.5,33.25 55,33.25
  Bottom 0.3: STM32.4 39.99,28.51 v39.5,29 | 52.5,33.25 v50,35.75 | Q2.12 55.17,33.08 55,33.25
USB_DM  (via drill 0.5)
  Top 0.3: v41,16.75 41.5,16.25 41.5,8 42,7.5 72.25,7.5 73.25,8.5 73.25,13.5 v77.75,18
  Bottom 0.3: STM32.44 40.49,16.24 v41,16.75 | R16.2 78.53,18.78 v77.75,18
USB_DP  (via drill 0.5)
  Top 0.3: v40.25,12.75 40.25,7.25 41,6.5 72.75,6.5 74.25,8 74.25,12.75 v78,16.5
  Bottom 0.3: STM32.45 39.99,13.01 v40.25,12.75 | R15.2 78.44,16.94 v78,16.5
USB_VBUS  (via drill 0.5)
  Top 0.3: v68.5,31.5 72,31.5 77,26.5 v77.5,26.5
  Bottom 0.3: Q2.5 66.92,33.08 v68.5,31.5 | v77.5,26.5 78.1,26.5 D5.A | TVS2.5 85,2.25 85.25,2.5 85.25,6.25 87,8 87.25,8 89.5,10.25 89.5,11.25 90,11.75 90,14.75 89,15.75 88,15.75 87.5,16.25 86.5,16.25 85.81,16.25 CON_USB.VBUS
  Bottom 0.4: CON_USB.VBUS 85.55,16.2 83.75,18
  Bottom 0.406: D5.A 81.15,25.35 81.75,24.75 81.75,21.5 83.75,19.5 83.75,18
VCC
  Bottom 0.3: R30.2 71.69,33.2 78,39.5 83.51,39.5
  Bottom 0.4: C1.1 91.29,34.01 90.93,34.22
  Bottom 0.6: D5.C 80.65,29.65 84,33 84,34.75 85.88,36.62
  Bottom 1: D1.C 83.51,39.5 83.51,38.99 85.88,36.62 86.75,35.75 87.75,35.75 88.25,35.25 90.43,35.25 90.93,34.75 90.93,34.22 90.93,32.95 IC_REG.3

### Text on the board
tPlace: REV A | MotoLink | Github.com/fpoussin/MotoLink | 1-3V3 | 2-SWCLK | 3-NRST | 1 | 4-GND | 5-NC | 6-SWDIO | 6